# Altium schematic sheet Inputs.SchDoc
size A3
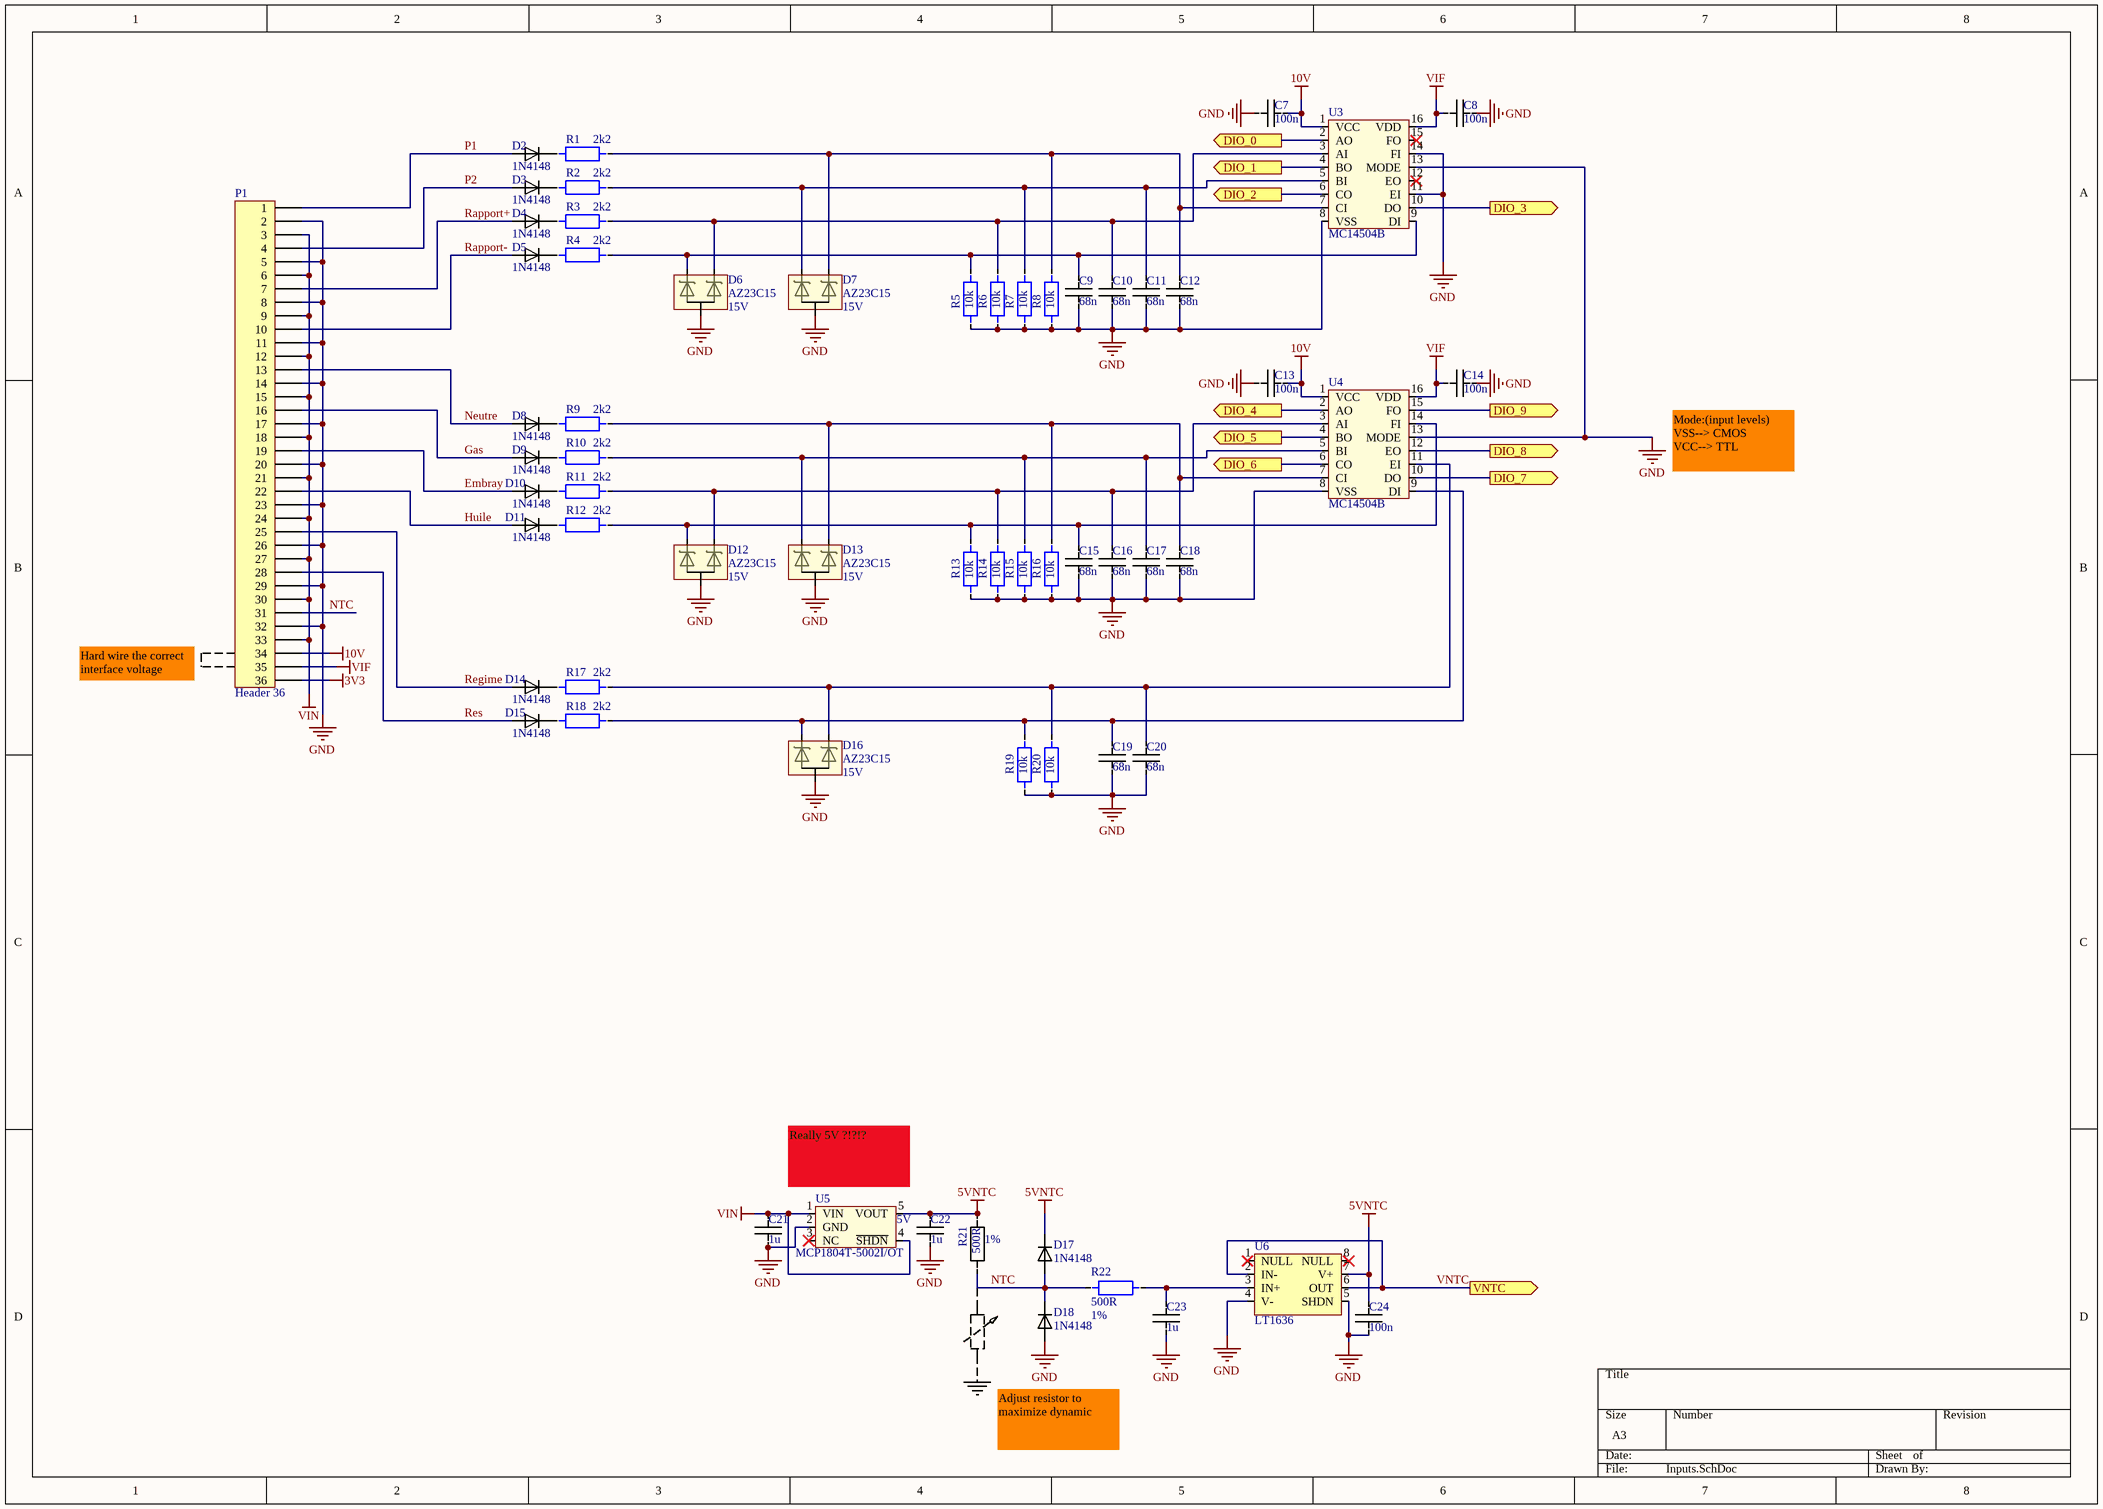
[diagram p0: Inputs.SchDoc]

## Parts
C7  100n  [0402_]
C8  100n  [0402_]
C9  68n  [0603_]
C10  68n  [0603_]
C11  68n  [0603_]
C12  68n  [0603_]
C13  100n  [0402_]
C14  100n  [0402_]
C15  68n  [0603_]
C16  68n  [0603_]
C17  68n  [0603_]
C18  68n  [0603_]
C19  68n  [0603_]
C20  68n  [0603_]
C21  1u  [0402_]
C22  1u  [0402_]
C23  1u  [0402_]
C24  100n  [0402_]
D2  1N4148  [SOD323]
D3  1N4148  [SOD323]
D4  1N4148  [SOD323]
D5  1N4148  [SOD323]
D6  AZ23C15  Vz: 15V  [SOT23]
D7  AZ23C15  Vz: 15V  [SOT23]
D8  1N4148  [SOD323]
D9  1N4148  [SOD323]
D10  1N4148  [SOD323]
D11  1N4148  [SOD323]
D12  AZ23C15  Vz: 15V  [SOT23]
D13  AZ23C15  Vz: 15V  [SOT23]
D14  1N4148  [SOD323]
D15  1N4148  [SOD323]
D16  AZ23C15  Vz: 15V  [SOT23]
D17  1N4148  [SOD323]
D18  1N4148  [SOD323]
P1  Header 36  [PHOENIX_PTSA05_36]
R1  2k2  [0805_]
R2  2k2  [0805_]
R3  2k2  [0805_]
R4  2k2  [0805_]
R5  10k  [0402_]
R6  10k  [0402_]
R7  10k  [0402_]
R8  10k  [0402_]
R9  2k2  [0805_]
R10  2k2  [0805_]
R11  2k2  [0805_]
R12  2k2  [0805_]
R13  10k  [0402_]
R14  10k  [0402_]
R15  10k  [0402_]
R16  10k  [0402_]
R17  2k2  [0805_]
R18  2k2  [0805_]
R19  10k  [0402_]
R20  10k  [0402_]
R21  precision: 1%  [0805_]  (hidden comment: 500R)
R22  precision: 1%  [0805_]  (hidden comment: 500R)
U3  MC14504B  [SOIC16]
U4  MC14504B  [SOIC16]
U5  MCP1804T-5002I/OT  Rated volatage: 5V  [sot23-5]
U6  LT1636  [soic8]

## Ports
DIO_0 (out), DIO_1 (out), DIO_2 (out), DIO_3 (out), DIO_4 (out), DIO_5 (out), DIO_6 (out), DIO_7 (out), DIO_8 (out), DIO_9 (out), VNTC (out)

## Nets
3V3: P1.36
5VNTC: C22.1 C24.1 D17.2 R21.2 U5.5(VOUT) U6.7(V+)
10V: C7.1 C13.1 P1.34 U3.1(VCC) U4.1(VCC)
GND: C7.2 C8.1 C9.1 C10.1 C11.1 C12.1 C13.2 C14.1 C15.1 C16.1 C17.1 C18.1 C19.1 C20.1 C21.2 C22.2 C23.2 C24.2 D6.3 D7.3 D12.3 D13.3 D16.3 D18.1 P1.2 P1.5 P1.8 P1.11 P1.14 P1.17 P1.20 P1.23 P1.26 P1.29 P1.32 R5.1 R6.1 R7.1 R8.1 R13.1 R14.1 R15.1 R16.1 R19.1 R20.1 U3.8(VSS) U3.11(EI) U3.13(MODE) U3.14(FI) U4.8(VSS) U4.13(MODE) U5.2(GND) U6.4(V-) U6.5(SHDN)
VIF: C8.2 C14.2 P1.35 U3.16(VDD) U4.16(VDD)
VIN: C21.1 P1.3 P1.6 P1.9 P1.12 P1.15 P1.18 P1.21 P1.24 P1.27 P1.30 P1.33 U5.1(VIN) U5.4(~{SHDN})
DIO_0: U3.2(AO) ; port DIO_0
DIO_1: U3.4(BO) ; port DIO_1
DIO_2: U3.6(CO) ; port DIO_2
DIO_3: U3.10(DO) ; port DIO_3
DIO_4: U4.2(AO) ; port DIO_4
DIO_5: U4.4(BO) ; port DIO_5
DIO_6: U4.6(CO) ; port DIO_6
DIO_7: U4.10(DO) ; port DIO_7
DIO_8: U4.12(EO) ; port DIO_8
DIO_9: U4.15(FO) ; port DIO_9
Embray: D10.1 P1.19
Gas: D9.1 P1.16
Huile: D11.1 P1.22
Neutre: D8.1 P1.13
NTC: D17.1 D18.2 P1.31 R21.1 R22.2
P1: D2.1 P1.1
P2: D3.1 P1.4
Rapport+: D4.1 P1.7
Rapport-: D5.1 P1.10
Regime: D14.1 P1.25
Res: D15.1 P1.28
VNTC: U6.2(IN-) U6.6(OUT) ; port VNTC
NetC9_2: C9.2 D6.2 R4.1 R5.2 U3.9(DI)
NetC10_2: C10.2 D6.1 R3.1 R6.2 U3.3(AI)
NetC11_2: C11.2 D7.2 R2.1 R7.2 U3.5(BI)
NetC12_2: C12.2 D7.1 R1.1 R8.2 U3.7(CI)
NetC15_2: C15.2 D12.2 R12.1 R13.2 U4.14(FI)
NetC16_2: C16.2 D12.1 R11.1 R14.2 U4.3(AI)
NetC17_2: C17.2 D13.2 R10.1 R15.2 U4.5(BI)
NetC18_2: C18.2 D13.1 R9.1 R16.2 U4.7(CI)
NetC19_2: C19.2 D16.2 R18.1 R19.2 U4.9(DI)
NetC20_2: C20.2 D16.1 R17.1 R20.2 U4.11(EI)
NetC23_1: C23.1 R22.1 U6.3(IN+)
NetD2_2: D2.2 R1.2
NetD3_2: D3.2 R2.2
NetD4_2: D4.2 R3.2
NetD5_2: D5.2 R4.2
NetD8_2: D8.2 R9.2
NetD9_2: D9.2 R10.2
NetD10_2: D10.2 R11.2
NetD11_2: D11.2 R12.2
NetD14_2: D14.2 R17.2
NetD15_2: D15.2 R18.2

Not connected (* = marked no-connect by the designer): U3 12(EO)* 15(FO)*; U5 3(NC)*; U6 1(NULL)* 8(NULL)*

## Notes on the sheet
- Mode:(input levels)
  VSS--> CMOS
  VCC--> TTL
- Hard wire the correct interface voltage
- Really 5V ?!?!?
- Adjust resistor to maximize dynamic

## Library data of the parts
C7 C8 C13 C14 = C: Manufacturer: TDK Corp.; Manufacturer PartNum: C1005X5R1E104K050BC; value: 100n; Digikey ref: 445-4964-1-ND
C9-C12 C15-C20 = C: Manufacturer: Samsung; Manufacturer PartNum: CL10B683KB8NNNC; Nominal voltage: 50V; Digikey ref: 1276-1814-1-ND; Value: 68n
C21-C23 = C: Manufacturer PartNum: GRM155R61E105MA12D; Manufacturer: Murata; Nominal voltage: 25V; value: 1u; Digikey ref: 490-10018-1-ND
C24 = C: Manufacturer: TDK Corp.; Manufacturer PartNum: C1005X5R1E104K050BC; Voltage: 25V; value: 100n; Digikey ref: 445-4964-1-ND
D2-D5 D8-D11 D14 D15 D17 D18 = 1N4148: Manufacturer: Micro Commercial Co; Manufacturer PartNum: 1N4148WX-TP; Digikey ref: 1N4148WXTPMSCT-ND
D6 D7 D12 D13 D16 = AZ23C15: DIODE ZENER ARRAY 15V SOT23-3; Manufacturer PartNum: AZ23C15-7-F; Manufacturer: Diodes Inc.; Digikey ref: AZ23C15-FDICT-ND
P1 = Header 36: Header, 36-Pin; Manufacturer PartNum: 1990164; Manufacturer: Phoenix Contact; LatestRevisionDate: 17-Jul-2002; LatestRevisionNote: Re-released for DXP Platform.; Publisher: Altium Limited; Digikey ref: 277-1810-ND
R1-R4 R9-R12 R17 R18 = R: Manufacturer: Yageo; Manufacturer PartNum: RC0805JR-072K2L; value: 2k2; Digikey ref: 311-2.2KARCT-ND
R5-R8 R13-R16 R19 R20 = R: Manufacturer PartNum: ERJ-2RKF1002X; Manufacturer: Panasonic; value: 10k; Digikey ref: P10.0KLCT-ND
R21 R22 = R: Manufacturer PartNum: RC0805FR-07510RL; Manufacturer: Yageo; value: 500R; Digikey ref: 311-510CRCT-ND
U3 U4 = MC14504B: IC LEVEL SHIFTER HEX 16-SOIC; Manufacturer: On Semi; Manufacturer PartNum: MC14504BDG; Digikey ref: MC14504BDGOS-ND
U5 = MCP1804T-5002I/OT: IC REG LDO 5V 0.15A SOT23-5; Manufacturer: Microchip; Digikey ref: MCP1804T-5002I/OTCT-ND; Manufacturer PartNum: MCP1804T-5002I/OT
U6 = LT1636: IC OPAMP GP 220KHZ RRO 8SO SHTDN; Manufacturer PartNum: LT1636CS8#PBF; Manufacturer: Linear Technology; Digikey ref: LT1636CS8#PBF-ND